# Altium project ESP32-HWE-Dev.PrjPcb
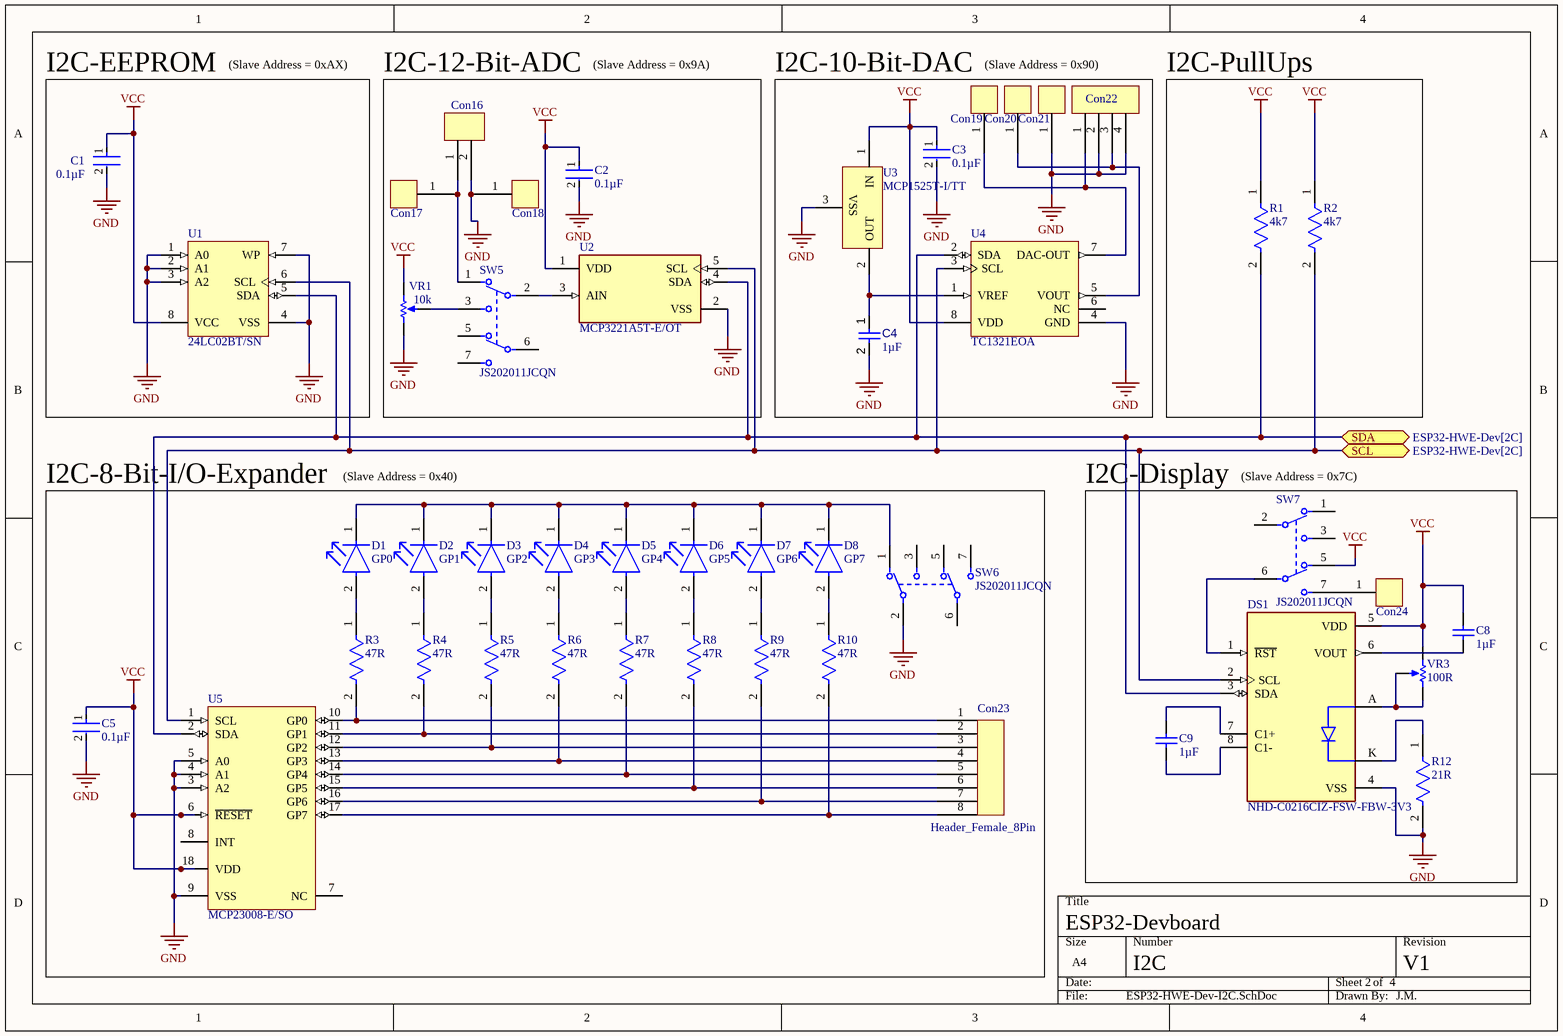
[diagram p0: ESP32-HWE-Dev-I2C.SchDoc]
4 sheets, 102 parts. Net scope: flat (ports and power ports of the same name join across sheets).
Board file: ESP32-HWE-Dev.PcbDoc
Sheets:
  ESP32-HWE-Dev-I2C.SchDoc
  ESP32-HWE-Dev-SPI.SchDoc
  ESP32-HWE-Dev.SchDoc
  ESP32-HWE-Dev-Power.SchDoc

## Sheet ESP32-HWE-Dev-I2C.SchDoc
size A4; SheetNumber: 1; SheetTotal: 4

### Parts
C1  0.1µF  [FP-0805-L_2_01_0_2-W_1_25-IPC_C]
C2  0.1µF  [FP-0805-L_2_01_0_2-W_1_25-IPC_C]
C3  0.1µF  [FP-0805-L_2_01_0_2-W_1_25-IPC_C]
C4  value 1µF  [CAPC2013X135X45NL10T25]  (hidden comment: Capacitor 1 uF +/- 10% 50 V 0805)
C5  0.1µF  [FP-0805-L_2_01_0_2-W_1_25-IPC_C]
C8  1µF  [CAPC2013X145X50LL20T25]
C9  1µF  [CAPC2013X145X50LL20T25]
Con16  Female 2 Pin  [Header_Female_2Pin]  (value not drawn)
Con17  Solder Nail RTM 1.3  [Solder_Nail_RTM_1.3]  (value not drawn)
Con18  Solder Nail RTM 1.3  [Solder_Nail_RTM_1.3]  (value not drawn)
Con19  I2C-DAC-DAC-Out  [Solder_Nail_RTM_1.3]  (value not drawn)
Con20  I2C-DAC-Vout  [Solder_Nail_RTM_1.3]  (value not drawn)
Con21  DAC-GND  [Solder_Nail_RTM_1.3]  (value not drawn)
Con22  Female 4 Pin  [Header_Female_4Pin]  (value not drawn)
Con23  Header_Female_8Pin  [Header_Female_8Pin]
Con24  Solder Nail RTM 1.3  [Solder_Nail_RTM_1.3]  (value not drawn)
D1  GP0  [FP-SML-LXT0805IW-TR-MFG]
D2  GP1  [FP-SML-LXT0805IW-TR-MFG]
D3  GP2  [FP-SML-LXT0805IW-TR-MFG]
D4  GP3  [FP-SML-LXT0805IW-TR-MFG]
D5  GP4  [FP-SML-LXT0805IW-TR-MFG]
D6  GP5  [FP-SML-LXT0805IW-TR-MFG]
D7  GP6  [FP-SML-LXT0805IW-TR-MFG]
D8  GP7  [FP-SML-LXT0805IW-TR-MFG]
DS1  NHD-C0216CIZ-FSW-FBW-3V3  [LCD_NHD-C0216CIZ-FSW-FBW-3V3]
R1  4k7  [FP-AC0805-MFG]
R2  4k7  [FP-AC0805-MFG]
R3  47R  [FP-AC0805-MFG]
R4  47R  [FP-AC0805-MFG]
R5  47R  [FP-AC0805-MFG]
R6  47R  [FP-AC0805-MFG]
R7  47R  [FP-AC0805-MFG]
R8  47R  [FP-AC0805-MFG]
R9  47R  [FP-AC0805-MFG]
R10  47R  [FP-AC0805-MFG]
R12  21R  [FP-AC0805-MFG]
SW5  JS202011JCQN  [FP-JS202011JCQN-MFG]
SW6  JS202011JCQN  [FP-JS202011JCQN-MFG]
SW7  JS202011JCQN  [FP-JS202011JCQN-MFG]
U1  24LC02BT/SN  [SOIC-SN8_N]
U2  MCP3221A5T-E/OT  [FP-C04-091-OT-IPC_A]
U3  MCP1525T-I/TT  [SOT-23-TT3_M]
U4  TC1321EOA  [SOIC-OA8_L]
U5  MCP23008-E/SO  [SOIC-SO18_N]
VR1  10k  [BOUR-3362P]
VR3  100R  [BOUR-3362P]

### Blocks framed on the sheet
I2C-EEPROM: C1 U1
I2C-12-Bit-ADC: C2 Con16-Con18 SW5 U2 VR1
I2C-10-Bit-DAC: C3 C4 Con19-Con22 U3 U4
I2C-PullUps: R1 R2
I2C-8-Bit-I/O-Expander: C5 Con23 D1-D8 R3-R10 SW6 U5
I2C-Display: C8 C9 Con24 DS1 R12 SW7 VR3

### Ports
SCL (bidir, see ESP32-HWE-Dev[2C]), SDA (bidir, see ESP32-HWE-Dev[2C])

### Nets
GND: C1.2 C2.2 C3.2 C4.2 C5.2 Con16.2 Con18.1 Con21.1 Con22.2 Con22.4 DS1.4(VSS) R12.2 SW6.2(1_C) U1.1(A0) U1.2(A1) U1.3(A2) U1.4(VSS) U1.7(WP) U2.2(VSS) U3.3(VSS) U4.4(GND) U5.3(A2) U5.4(A1) U5.5(A0) U5.9(VSS) VR1.1(CCW)
VCC: C1.1 C2.1 C3.1 C5.1 C8.2 DS1.5(VDD) R1.1 R2.1 SW7.5 U1.8(VCC) U2.1(VDD) U3.1(IN) U4.8(VDD) U5.6(~{RESET}) U5.18(VDD) VR1.3(CW) VR3.1(CCW)
NetC4_1: C4.1 U3.2(OUT) U4.1(VREF)
NetC8_1: C8.1 DS1.6(VOUT)
NetC9_1: C9.1 DS1.8(C1-)
NetC9_2: C9.2 DS1.7(C1+)
NetCon16_1: Con16.1 Con17.1 SW5.1
NetCon19_1: Con19.1 Con22.1 U4.7(DAC-OUT)
NetCon20_1: Con20.1 Con22.3 U4.5(VOUT)
NetCon23_1: Con23.1 R3.2 U5.10(GP0)
NetCon23_2: Con23.2 R4.2 U5.11(GP1)
NetCon23_3: Con23.3 R5.2 U5.12(GP2)
NetCon23_4: Con23.4 R6.2 U5.13(GP3)
NetCon23_5: Con23.5 R7.2 U5.14(GP4)
NetCon23_6: Con23.6 R8.2 U5.15(GP5)
NetCon23_7: Con23.7 R9.2 U5.16(GP6)
NetCon23_8: Con23.8 R10.2 U5.17(GP7)
NetCon24_1: Con24.1 SW7.7
NetD1_1: D1.1(C) D2.1(C) D3.1(C) D4.1(C) D5.1(C) D6.1(C) D7.1(C) D8.1(C) SW6.1
NetD1_2: D1.2(A) R3.1
NetD2_2: D2.2(A) R4.1
NetD3_2: D3.2(A) R5.1
NetD4_2: D4.2(A) R6.1
NetD5_2: D5.2(A) R7.1
NetD6_2: D6.2(A) R8.1
NetD7_2: D7.2(A) R9.1
NetD8_2: D8.2(A) R10.1
NetDS1_1: DS1.1(~{RST}) SW7.6(2_C)
NetDS1_2: DS1.2(SCL) R2.2 U1.6(SCL) U2.5(SCL) U4.3(SCL) U5.1(SCL) ; port SCL
NetDS1_3: DS1.3(SDA) R1.2 U1.5(SDA) U2.4(SDA) U4.2(SDA) U5.2(SDA) ; port SDA
NetDS1_A: DS1.A VR3.2(S) VR3.3(CW)
NetDS1_K: DS1.K R12.1
NetSW5_2: SW5.2(1_C) U2.3(AIN)
NetSW5_3: SW5.3 VR1.2(S)

Not connected (* = marked no-connect by the designer): SW5 5 6(2_C) 7; SW6 3 5 6(2_C) 7; SW7 1 2(1_C) 3; U4 6(NC); U5 7(NC) 8(INT)

### Notes on the sheet
- (Slave Address = 0xAX)
- (Slave Address = 0x9A)
- (Slave Address = 0x90)
- (Slave Address = 0x40)
- (near SW7) (Slave Address = 0x7C)
- ESP32-Devboard
- I2C
- 2
- 4
- V1
- J.M.

### Library data of the parts
C1-C3 C5 = CMP-2000-05016-2: General Purpose Ceramic Capacitor, 0805, 100nF, 10%, X7R, 0.15, 50V; Dissipation Factor: 2.5%; Insulation Resistance: 100GR; Voltage Rating (DC): 50V; Package Quantity: 4000; Tolerance: 10%; Voltage Rating: 50V; Dielectric: X7R; Case/Package: 0805; Lead Free: Lead Free; Dielectric Material: Ceramic; Thickness: 0.037inch; Weight: 0.001411oz; Max Operating Temperature: 125°C; REACH SVHC: No SVHC; Mount: Surface Mount; RoHS Compliant: Yes; Depth: 1.25mm; Height: 0.5mm; Case Code (Metric): 2012; Length: 2mm; Termination: Standard; Case Code (Imperial): 0805; Number of Pins: 2; Voltage: 50V; Radiation Hardening: No; Min Operating Temperature: -55°C; Capacitance: 100nF; Width: 1.2mm; Series: MLCC X7R; Packaging: Cut Tape
C4 = CMP-001-00007-6: Chip Capacitor, 1 uF, +/- 10%, 50 V, 0805 (2012 Metric); Capacitor Type: Ceramic; Voltage Rating: 50V; Min Operating Temperature: -55°C; RoHS Compliant: True; Mounting Technology: SM; Case/Package: 0805; Max Operating Temperature: 125°C; Tolerance: 10%; Pins: 2
C8 C9 = CMP-1036-04746-2: Manufacturer: Kemet; Part Number: C0805C105K4PACTU
Con16 = Header_Female_2Pin
Con17-Con21 Con24 = Solder_Nail_RTM_1.3
Con22 = Header_Female_4Pin
D1-D8 = CMP-1724-00002-2: LED RED DIFFUSED SMD; Lens Style: Rectangular; Luminous Intensity: 11mcd; Approvals: UL; Test Current: 20mA; Forward Voltage: 2V; Number of LEDs: 1; Wavelength: 635nm; Lens Color: White; Viewing Angle: 140°; Min Operating Temperature: -25°C; Case Code (Metric): 2012; Mount: Surface Mount; Case Code (Imperial): 0805; Height: 0.8mm; Lead Free: Lead Free; Color: Red; Package Quantity: 1; Illumination Color: Red; Lens Transparency: Diffused; Forward Current: 20mA; Packaging: Tape and Reel; Length: 2mm; Case/Package: 0805; REACH SVHC: No SVHC; Width: 1.25mm; Number of Pins: 2; Max Operating Temperature: 80°C; Dominant Wavelength: 635nm
DS1 = NHD-C0216CIZ-FSW-FBW-3V3: Character Display FSTN Transflective 16Char x 2Line 8-Pin; MF: {'manufacturer': u'Newhaven'}; Package: None; Price: None; Value: *; MP: NHD-C0216CIZ-FSW-FBW-3V3; Availability: Unavailable; ComponentLink1Description: Datasheet; ComponentLink1URL: https://s3.amazonaws.com/snapeda/datasheet/NHD-C0216CIZ-FSW-FBW-3V3_Newhaven.pdf
R1-R10 R12 = CMP-2001-04476-2: RES SMD 4.7K OHM 5% 1/8W 0805; Manufacturer: Yageo; Manufacturer Part Number: AC0805JR-074K7L; Tolerance: 0.05; Value: 4.7KΩ; Voltage Rating: 150V; Automotive Grade: Grade 0; ComponentLink2URL: http://www.yageo.com/documents/recent/PYu-AC_51_RoHS_L_6.pdf; Power Rating: 1/8W; Package: AC0805; Mouser Description: Thick Film Resistors - SMD 1/8W 4.7K ohm 5% AEC-Q200; Height: 0.6mm; Device Class L2: Resistors; ComponentLink2Description: Datasheet; Series: AC; RoHS: TRUE; Resistance: 4.7KΩ; Digikey Description: RES SMD 4.7K OHM 5% 1/8W 0805; Lead Free: Yes; Category: Res; Temperature Range Low: -55°C; Temperature Range High: +155°C; Composition: Thick Film; Device Class L3: Chip SMD Resistors; Device Class L1: Passive Components; Automotive: Yes; Octopart: https://octopart.com/ac0805jr-074k7l-yageo-26638632; Temperature: -55°C to +155°C; Ipc Land Pattern Name: RESC200125X50; Footprint Url: http://www.yageo.com/exep/pages/download/literatures/PYu-R_Mount_10.pdf
SW5-SW7 = CMP-10038-000009-1: SWITCH SLIDE DPDT 300MA 6V; Actuator Material: Nylon; Actuator Length: 2mm; Actuator Type: Standard; Electrical Life: 5000Cycles; Switch Function: On-On; Mount: Surface Mount; Current Rating: 300mA; Contact Material: Copper Alloy; Voltage Rating (DC): 6V; Throw Configuration: DPDT; Packaging: Cut Tape; Contact Plating: Silver; Min Operating Temperature: -40°C; Switch Travel: 2mm; Max Operating Temperature: 85°C
U1 = CMP-0159-00324-1: 2Kbit, 400kHz, 2.5V, I2C Serial EEPROM, 8-Pin SOIC 150mil, Commercial Temperature, Tape and Reel; Code_JEDEC: MS-012; PackageVersion: revBB, Aug-2009; DatasheetVersion: revJ, Feb-2009; PackageDescription: 8-Lead Plastic Small Outline (SN) - Narrow, 3.90mm Body [SOIC]; PackageReference: SOIC-SN8; Code_IPC: SOIC127P600-8
U2 = CMP-0188-00729-3: IC ADC 12BIT SAR SOT23-5; Number of Bits: 12; Number of Analog Inputs: 1; Min Supply Voltage: 2.7V; Integral Nonlinearity (INL): 2LSB; Sampling Rate: 22.3KS/s; Polarity: Unipolar; Interface: I2C; Max Supply Voltage: 5.5V; Resolution: 12b; Nominal Supply Current: 175uA; REACH SVHC: No SVHC; Packaging: Tape and Reel; Height: 1.3mm; Number of Channels: 1; Max Operating Temperature: 125°C; Mount: Surface Mount; Width: 1.8mm; Lead Free: Lead Free; Length: 3.1mm; Number of A/D Converters: 1; Number of Inputs: 1; Case/Package: SOT-23; Package Quantity: 3000; Conversion Rate: 22.3KS/s; Number of Converters: 1; Number of Elements: 1; Min Operating Temperature: -40°C; Number of Pins: 5; Termination: SMD/SMT; Radiation Hardening: No
U3 = CMP-0131-00003-1: 2.5V Voltage Reference, 3-Pin SOT-23, Industrial Temperature, Tape and Reel; DatasheetVersion: revB, Feb-2005; Code_IPC: SOT23-3; PackageDescription: 3-Lead Plastic Small Outline Transistor (TT) [SOT-23]; PackageReference: SOT-23-TT3; PackageVersion: revBB, Aug-2009
U4 = CMP-0188-00049-2: 10-Bit Digital-to-Analog Converter with Two-Wire Interface, 8-Pin SOIC 150mil, Extended Temperature; ComponentLink3URL: http://www.microchip.com/stellent/groups/techpub_sg/documents/packagingspec/en012702.pdf; ComponentLink2Description: Datasheet; ComponentLink1Description: Manufacturer URL; Code_IPC: SOIC127P600-8; ComponentLink2URL: http://ww1.microchip.com/downloads/en/DeviceDoc/21387C.pdf; PackageReference: SOIC-OA8; RevisionNote: URLs added. DatasheetVersion updated.; ComponentLink1URL: http://www.microchip.com/; DatasheetVersion: revC, Nov-2010; PackageVersion: revBB, Aug-2009; PackageDescription: 8-Lead Plastic Small Outline (OA) - Narrow, 3.90mm Body [SOIC]; ComponentLink3Description: Package Specification
U5 = CMP-0186-00050-2: 8-Bit I/O Expander with Serial Interface, 18-Pin SOIC, Extended Temperature; PackageDescription: 18-Lead Plastic Small Outline (SO) - Wide 7.50mm Body [SOIC]; ComponentLink3Description: Package Specification; ComponentLink2Description: Datasheet; ComponentLink2URL: http://ww1.microchip.com/downloads/en/DeviceDoc/21919e.pdf; RevisionNote: URLs added.; ComponentLink1URL: http://www.microchip.com/; ComponentLink3URL: http://www.microchip.com/stellent/groups/techpub_sg/documents/packagingspec/en012702.pdf; ComponentLink1Description: Manufacturer URL; PackageReference: SOIC-SO18; DatasheetVersion: revE, Aug-2007; PackageVersion: revBB, Aug-2009; Code_JEDEC: MS-013
VR1 VR3 = CMP-1747-00004-1: Square Trimpot(R) Trimming Potentiometer, 10 KOhm, 300 V, -55 to 125 degC, 3-Pin THD, RoHS, Tube; Voltage Rating: 220 mV; Power Rating: 1 W; Tolerance: 1%; Resistance: 50 mohm; Case/Package: 1206; Length: 3.2 mm; RoHSCompliant: True; PackageDescription: 3-Pin Through Hole Device, Body 6.6 x 6.99 mm, Pitch 2.54 mm; ComponentLink2Description: Datasheet; REACH SVHC: No SVHC; Mount: Surface Mount; Height: 0.6 mm; Packaging: Tape and Reel; ComponentLink1URL: http://www.bourns.com/; Case Code (Imperial): 0612; Pins: 2; Case Code (Metric): 1632; ComponentLink2URL: http://www.bourns.com/docs/Product-Datasheets/3362.pdf; Min Operating Temperature: -25degC; ComponentLink1Description: Manufacturer URL; PackageReference: 3326P; Max Operating Temperature: 125degC; Width: 1.6 mm; Package Quantity: 5000; DatasheetVersion: May-16

## Sheet ESP32-HWE-Dev-SPI.SchDoc
size A4; SheetNumber: 2; SheetTotal: 4
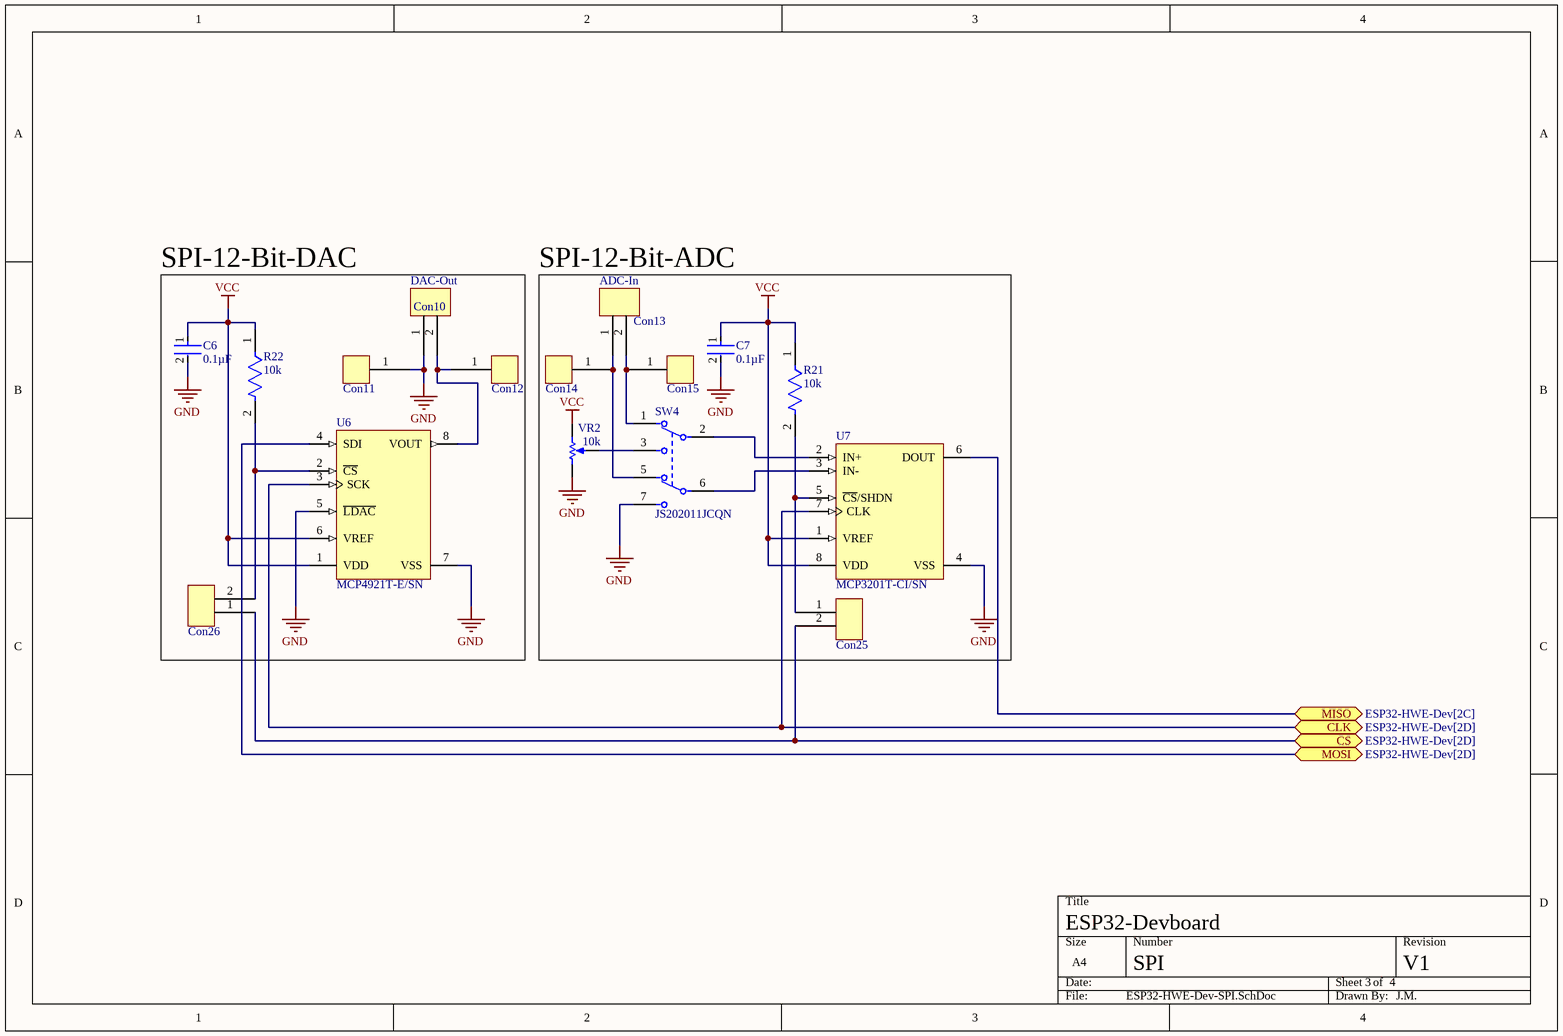
[diagram p1: ESP32-HWE-Dev-SPI.SchDoc]

### Parts
C6  0.1µF  [FP-0805-L_2_01_0_2-W_1_25-IPC_C]
C7  0.1µF  [FP-0805-L_2_01_0_2-W_1_25-IPC_C]
Con10  DAC-Out  [Header_Female_2Pin]
Con11  Solder Nail RTM 1.3  [Solder_Nail_RTM_1.3]  (value not drawn)
Con12  Solder Nail RTM 1.3  [Solder_Nail_RTM_1.3]  (value not drawn)
Con13  ADC-In  [Header_Female_2Pin]
Con14  Solder Nail RTM 1.3  [Solder_Nail_RTM_1.3]  (value not drawn)
Con15  Solder Nail RTM 1.3  [Solder_Nail_RTM_1.3]  (value not drawn)
Con25  Male 2 Pin  [Header_Male_2Pin]  (value not drawn)
Con26  Male 2 Pin  [Header_Male_2Pin]  (value not drawn)
R21  10k  [FP-AC0805-MFG]
R22  10k  [FP-AC0805-MFG]
SW4  JS202011JCQN  [FP-JS202011JCQN-MFG]
U6  MCP4921T-E/SN  [SOIC-SN8_L]
U7  MCP3201T-CI/SN  [SOIC-SN8_M]
VR2  10k  [BOUR-3362P]

### Blocks framed on the sheet
SPI-12-Bit-DAC: C6 Con10-Con12 Con26 R22 U6
SPI-12-Bit-ADC: C7 Con13-Con15 Con25 R21 SW4 U7 VR2

### Ports
CLK (bidir, see ESP32-HWE-Dev[2D]), CS (bidir, see ESP32-HWE-Dev[2D]), MISO (bidir, see ESP32-HWE-Dev[2C]), MOSI (bidir, see ESP32-HWE-Dev[2D])

### Nets
GND: C6.2 C7.2 Con10.1 Con11.1 SW4.7 U6.5(~{LDAC}) U6.7(VSS) U7.4(VSS) VR2.1(CCW)
VCC: C6.1 C7.1 R21.1 R22.1 U6.1(VDD) U6.6(VREF) U7.1(VREF) U7.8(VDD) VR2.3(CW)
NetCon10_2: Con10.2 Con12.1 U6.8(VOUT)
NetCon13_1: Con13.1 Con14.1 SW4.5
NetCon13_2: Con13.2 Con15.1 SW4.1
NetCon25_1: Con25.1 R21.2 U7.5(~{CS}/SHDN)
NetCon25_2: Con25.2 Con26.1 ; port CS
NetCon26_2: Con26.2 R22.2 U6.2(~{CS})
NetSW2_2: U7.6(DOUT) ; port MISO
NetSW2_6: U6.4(SDI) ; port MOSI
NetSW3_2: U6.3(SCK) U7.7(CLK) ; port CLK
NetSW4_2: SW4.2(1_C) U7.2(IN+)
NetSW4_3: SW4.3 VR2.2(S)
NetSW4_6: SW4.6(2_C) U7.3(IN-)

### Notes on the sheet
- ESP32-Devboard
- SPI
- 3
- 4
- V1
- J.M.

### Library data of the parts
C6 C7 = CMP-2000-05016-2: as C1 on sheet ESP32-HWE-Dev-I2C; Voltage Rating (DC): 50V; Package Quantity: 4000; Tolerance: 10%; Voltage Rating: 50V; Dielectric: X7R; Case/Package: 0805; Lead Free: Lead Free; Dielectric Material: Ceramic; Thickness: 0.037inch; Weight: 0.001411oz; Max Operating Temperature: 125°C; REACH SVHC: No SVHC; Mount: Surface Mount; RoHS Compliant: Yes; Depth: 1.25mm; Height: 0.5mm; Case Code (Metric): 2012; Length: 2mm; Termination: Standard; Case Code (Imperial): 0805; Number of Pins: 2; Voltage: 50V; Radiation Hardening: No; Min Operating Temperature: -55°C; Capacitance: 100nF; Width: 1.2mm; Series: MLCC X7R; Packaging: Cut Tape
Con10 Con13 = Header_Female_2Pin
Con11 Con12 Con14 Con15 = Solder_Nail_RTM_1.3
Con25 Con26 = Header_Male_2Pin
R21 R22 = CMP-2001-04476-2: as R1 on sheet ESP32-HWE-Dev-I2C; ComponentLink2URL: http://www.yageo.com/documents/recent/PYu-AC_51_RoHS_L_6.pdf; Power Rating: 1/8W; Package: AC0805; Mouser Description: Thick Film Resistors - SMD 1/8W 4.7K ohm 5% AEC-Q200; Height: 0.6mm; Device Class L2: Resistors; ComponentLink2Description: Datasheet; Series: AC; RoHS: TRUE; Resistance: 4.7KΩ; Digikey Description: RES SMD 4.7K OHM 5% 1/8W 0805; Lead Free: Yes; Category: Res; Temperature Range Low: -55°C; Temperature Range High: +155°C; Composition: Thick Film; Device Class L3: Chip SMD Resistors; Device Class L1: Passive Components; Automotive: Yes; Octopart: https://octopart.com/ac0805jr-074k7l-yageo-26638632; Temperature: -55°C to +155°C; Ipc Land Pattern Name: RESC200125X50; Footprint Url: http://www.yageo.com/exep/pages/download/literatures/PYu-R_Mount_10.pdf
SW4 = CMP-10038-000009-1: as SW5 on sheet ESP32-HWE-Dev-I2C; Mount: Surface Mount; Current Rating: 300mA; Contact Material: Copper Alloy; Voltage Rating (DC): 6V; Throw Configuration: DPDT; Packaging: Cut Tape; Contact Plating: Silver; Min Operating Temperature: -40°C; Switch Travel: 2mm; Max Operating Temperature: 85°C
U6 = CMP-0188-00494-2: 12-Bit DAC with SPI Interface, 8-Pin SOIC 150mil, Extended Temperature, Tape and Reel; DatasheetVersion: revA, Apr-2010; RevisionNote: URLs added. DatasheetVersion updated. Sch updated.; ComponentLink2Description: Datasheet; ComponentLink3Description: Package Specification; ComponentLink1Description: Manufacturer URL; ComponentLink2URL: http://ww1.microchip.com/downloads/en/DeviceDoc/22248a.pdf; PackageDescription: 8-Lead Plastic Small Outline (SN) - Narrow, 3.90mm Body [SOIC]; PackageVersion: revBB, Aug-2009; Code_JEDEC: MS-012; Code_IPC: SOIC127P600-8; ComponentLink1URL: http://www.microchip.com/; PackageReference: SOIC-SN8; ComponentLink3URL: http://www.microchip.com/stellent/groups/techpub_sg/documents/packagingspec/en012702.pdf
U7 = CMP-0188-00467-2: 2.7V 12-Bit A/D Converter with SPI Serial Interface, 8-Pin SOIC 150mil, C Performance Grade, Industrial Temperature, Tape and Reel; RevisionNote: URLs added. DatasheetVersion updated.; PackageVersion: revBB, Aug-2009; ComponentLink2URL: http://ww1.microchip.com/downloads/en/DeviceDoc/21290F.pdf; DatasheetVersion: revF, Aug-2011; ComponentLink1URL: http://www.microchip.com/; Code_IPC: SOIC127P600-8; ComponentLink1Description: Manufacturer URL; ComponentLink3Description: Package Specification; PackageReference: SOIC-SN8; ComponentLink3URL: http://www.microchip.com/stellent/groups/techpub_sg/documents/packagingspec/en012702.pdf; PackageDescription: 8-Lead Plastic Small Outline (SN) - Narrow, 3.90mm Body [SOIC]; Code_JEDEC: MS-012; ComponentLink2Description: Datasheet
VR2 = CMP-1747-00004-1: as VR1 on sheet ESP32-HWE-Dev-I2C; Case/Package: 1206; Length: 3.2 mm; RoHSCompliant: True; PackageDescription: 3-Pin Through Hole Device, Body 6.6 x 6.99 mm, Pitch 2.54 mm; ComponentLink2Description: Datasheet; REACH SVHC: No SVHC; Mount: Surface Mount; Height: 0.6 mm; Packaging: Tape and Reel; ComponentLink1URL: http://www.bourns.com/; Case Code (Imperial): 0612; Pins: 2; Case Code (Metric): 1632; ComponentLink2URL: http://www.bourns.com/docs/Product-Datasheets/3362.pdf; Min Operating Temperature: -25degC; ComponentLink1Description: Manufacturer URL; PackageReference: 3326P; Max Operating Temperature: 125degC; Width: 1.6 mm; Package Quantity: 5000; DatasheetVersion: May-16

## Sheet ESP32-HWE-Dev.SchDoc
size A4; SheetNumber: 3; SheetTotal: 4
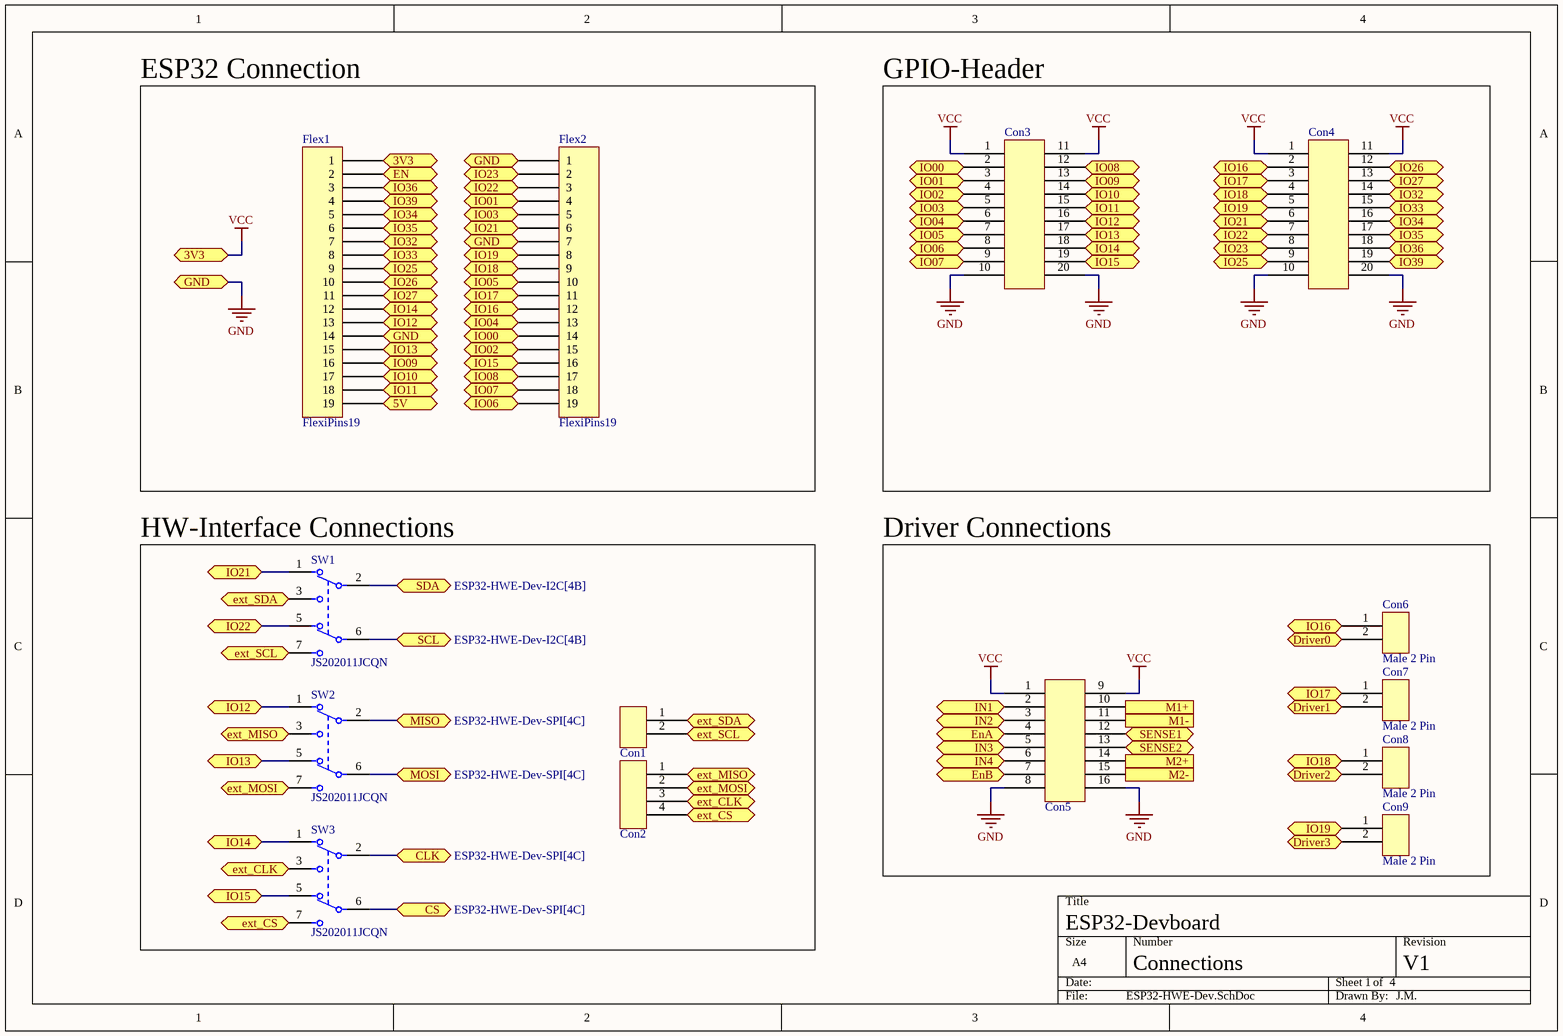
[diagram p2: ESP32-HWE-Dev.SchDoc]

### Parts
Con1  Female 2 Pin  [Header_Female_2Pin]  (value not drawn)
Con2  Female 4 Pin  [Header_Female_4Pin]  (value not drawn)
Con3  Female 2x10 Pin  [Header_Female_2x10Pin]  (value not drawn)
Con4  Female 2x10 Pin  [Header_Female_2x10Pin]  (value not drawn)
Con5  Female 2x8 Pin  [Header_Female_2x8Pin]  (value not drawn)
Con6  Male 2 Pin  [Header_Male_2Pin]
Con7  Male 2 Pin  [Header_Male_2Pin]
Con8  Male 2 Pin  [Header_Male_2Pin]
Con9  Male 2 Pin  [Header_Male_2Pin]
Flex1  FlexiPins19  [FlexiPins19]
Flex2  FlexiPins19  [FlexiPins19]
SW1  JS202011JCQN  [FP-JS202011JCQN-MFG]
SW2  JS202011JCQN  [FP-JS202011JCQN-MFG]
SW3  JS202011JCQN  [FP-JS202011JCQN-MFG]

### Blocks framed on the sheet
ESP32 Connection: Flex1 Flex2
GPIO-Header: Con3 Con4
HW-Interface Connections: Con1 Con2 SW1-SW3
Driver Connections: Con5-Con9

### Ports
3V3 (bidir, see ESP32-HWE-Dev[1A]), 5V (bidir), CLK (bidir, see ESP32-HWE-Dev-SPI[4C]), CS (bidir, see ESP32-HWE-Dev-SPI[4C]), Driver0 (bidir, see ESP32-HWE-Dev-Power[2B]), Driver1 (bidir, see ESP32-HWE-Dev-Power[3B]), Driver2 (bidir, see ESP32-HWE-Dev-Power[2C]), Driver3 (bidir, see ESP32-HWE-Dev-Power[3C]), EN (bidir), EnA (bidir, see ESP32-HWE-Dev-Power[1C]), EnB (bidir, see ESP32-HWE-Dev-Power[1C]), ext_CLK (bidir, see ESP32-HWE-Dev[1D]), ext_CLK (bidir, see ESP32-HWE-Dev[2D]), ext_CS (bidir, see ESP32-HWE-Dev[1D]), ext_CS (bidir, see ESP32-HWE-Dev[2D]), ext_MISO (bidir, see ESP32-HWE-Dev[1C]), ext_MISO (bidir, see ESP32-HWE-Dev[2D]), ext_MOSI (bidir, see ESP32-HWE-Dev[1D]), ext_MOSI (bidir, see ESP32-HWE-Dev[2D]), ext_SCL (bidir, see ESP32-HWE-Dev[1C]), ext_SCL (bidir, see ESP32-HWE-Dev[2C]), ext_SDA (bidir, see ESP32-HWE-Dev[1C]), ext_SDA (bidir, see ESP32-HWE-Dev[2C]), GND (bidir, see ESP32-HWE-Dev[1B], ESP32-HWE-Dev[2A]), IN1 (bidir, see ESP32-HWE-Dev-Power[1C]), IN2 (bidir, see ESP32-HWE-Dev-Power[1C]), IN3 (bidir, see ESP32-HWE-Dev-Power[1C]), IN4 (bidir, see ESP32-HWE-Dev-Power[1C]), IO00 (bidir, see ESP32-HWE-Dev[2B]), IO00 (bidir, see ESP32-HWE-Dev[3A]), IO01 (bidir, see ESP32-HWE-Dev[2A]), IO01 (bidir, see ESP32-HWE-Dev[3A]), IO02 (bidir, see ESP32-HWE-Dev[2B]), IO02 (bidir, see ESP32-HWE-Dev[3A]), IO03 (bidir, see ESP32-HWE-Dev[2A]), IO03 (bidir, see ESP32-HWE-Dev[3A]), IO04 (bidir, see ESP32-HWE-Dev[2B]), IO04 (bidir, see ESP32-HWE-Dev[3A]), IO05 (bidir, see ESP32-HWE-Dev[2B]), IO05 (bidir, see ESP32-HWE-Dev[3A]), IO06 (bidir, see ESP32-HWE-Dev[2B]), IO06 (bidir, see ESP32-HWE-Dev[3A]), IO07 (bidir, see ESP32-HWE-Dev[2B]), IO07 (bidir, see ESP32-HWE-Dev[3B]), IO08 (bidir, see ESP32-HWE-Dev[2B]), IO08 (bidir, see ESP32-HWE-Dev[3A]), IO09 (bidir, see ESP32-HWE-Dev[1B]), IO09 (bidir, see ESP32-HWE-Dev[3A]), IO10 (bidir, see ESP32-HWE-Dev[1B]), IO10 (bidir, see ESP32-HWE-Dev[3A]), IO11 (bidir, see ESP32-HWE-Dev[1B]), IO11 (bidir, see ESP32-HWE-Dev[3A]), IO12 (bidir, see ESP32-HWE-Dev[1B], ESP32-HWE-Dev[1C]), IO12 (bidir, see ESP32-HWE-Dev[1B], ESP32-HWE-Dev[3A]), IO12 (bidir, see ESP32-HWE-Dev[1C], ESP32-HWE-Dev[3A]), IO13 (bidir, see ESP32-HWE-Dev[1B], ESP32-HWE-Dev[1C]), IO13 (bidir, see ESP32-HWE-Dev[1B], ESP32-HWE-Dev[3A]), IO13 (bidir, see ESP32-HWE-Dev[1C], ESP32-HWE-Dev[3A]), IO14 (bidir, see ESP32-HWE-Dev[1B], ESP32-HWE-Dev[1D]), IO14 (bidir, see ESP32-HWE-Dev[1B], ESP32-HWE-Dev[3A]), IO14 (bidir, see ESP32-HWE-Dev[1D], ESP32-HWE-Dev[3A]), IO15 (bidir, see ESP32-HWE-Dev[1D], ESP32-HWE-Dev[2B]), IO15 (bidir, see ESP32-HWE-Dev[1D], ESP32-HWE-Dev[3B]), IO15 (bidir, see ESP32-HWE-Dev[2B], ESP32-HWE-Dev[3B]), IO16 (bidir, see ESP32-HWE-Dev[2B], ESP32-HWE-Dev[4A]), IO16 (bidir, see ESP32-HWE-Dev[2B], ESP32-HWE-Dev[4C]), IO16 (bidir, see ESP32-HWE-Dev[4A], ESP32-HWE-Dev[4C]), IO17 (bidir, see ESP32-HWE-Dev[2B], ESP32-HWE-Dev[4A]), IO17 (bidir, see ESP32-HWE-Dev[2B], ESP32-HWE-Dev[4C]), IO17 (bidir, see ESP32-HWE-Dev[4A], ESP32-HWE-Dev[4C]), IO18 (bidir, see ESP32-HWE-Dev[2B], ESP32-HWE-Dev[4A]), IO18 (bidir, see ESP32-HWE-Dev[2B], ESP32-HWE-Dev[4C]), IO18 (bidir, see ESP32-HWE-Dev[4A], ESP32-HWE-Dev[4C]), IO19 (bidir, see ESP32-HWE-Dev[2A], ESP32-HWE-Dev[4A]), IO19 (bidir, see ESP32-HWE-Dev[2A], ESP32-HWE-Dev[4D]), IO19 (bidir, see ESP32-HWE-Dev[4A], ESP32-HWE-Dev[4D]), IO21 (bidir, see ESP32-HWE-Dev[1C], ESP32-HWE-Dev[2A]), IO21 (bidir, see ESP32-HWE-Dev[1C], ESP32-HWE-Dev[4A]), IO21 (bidir, see ESP32-HWE-Dev[2A], ESP32-HWE-Dev[4A]), IO22 (bidir, see ESP32-HWE-Dev[1C], ESP32-HWE-Dev[2A]), IO22 (bidir, see ESP32-HWE-Dev[1C], ESP32-HWE-Dev[4A]), IO22 (bidir, see ESP32-HWE-Dev[2A], ESP32-HWE-Dev[4A]), IO23 (bidir, see ESP32-HWE-Dev[2A]), IO23 (bidir, see ESP32-HWE-Dev[4A]), IO25 (bidir, see ESP32-HWE-Dev[1B]), IO25 (bidir, see ESP32-HWE-Dev[4B]), IO26 (bidir, see ESP32-HWE-Dev[1B]), IO26 (bidir, see ESP32-HWE-Dev[4A]), IO27 (bidir, see ESP32-HWE-Dev[1B]), IO27 (bidir, see ESP32-HWE-Dev[4A]), IO32 (bidir, see ESP32-HWE-Dev[1A]), IO32 (bidir, see ESP32-HWE-Dev[4A]), IO33 (bidir, see ESP32-HWE-Dev[1A]), IO33 (bidir, see ESP32-HWE-Dev[4A]), IO34 (bidir, see ESP32-HWE-Dev[1A]), IO34 (bidir, see ESP32-HWE-Dev[4A]), IO35 (bidir, see ESP32-HWE-Dev[1A]), IO35 (bidir, see ESP32-HWE-Dev[4A]), IO36 (bidir, see ESP32-HWE-Dev[1A]), IO36 (bidir, see ESP32-HWE-Dev[4A]), IO39 (bidir, see ESP32-HWE-Dev[1A]), IO39 (bidir, see ESP32-HWE-Dev[4B]), M1+ (in, see ESP32-HWE-Dev-Power[2C]), M1- (in, see ESP32-HWE-Dev-Power[2C]), M2+ (in, see ESP32-HWE-Dev-Power[2C]), M2- (in, see ESP32-HWE-Dev-Power[2C]), MISO (bidir, see ESP32-HWE-Dev-SPI[4C]), MOSI (bidir, see ESP32-HWE-Dev-SPI[4C]), SCL (bidir, see ESP32-HWE-Dev-I2C[4B]), SDA (bidir, see ESP32-HWE-Dev-I2C[4B]), SENSE1 (bidir, see ESP32-HWE-Dev-Power[2C]), SENSE2 (bidir, see ESP32-HWE-Dev-Power[2C])

### Nets
GND: Con3.10 Con3.20 Con4.10 Con4.20 Con5.8 Con5.16 Flex1.14 Flex2.1 Flex2.7 ; port GND
VCC: Con3.1 Con3.11 Con4.1 Con4.11 Con5.1 Con5.9 Flex1.1 ; port 3V3
NetCon1_1: Con1.1 SW1.3 ; port ext_SDA
NetCon1_2: Con1.2 SW1.7 ; port ext_SCL
NetCon2_1: Con2.1 SW2.3 ; port ext_MISO
NetCon2_2: Con2.2 SW2.7 ; port ext_MOSI
NetCon2_3: Con2.3 SW3.3 ; port ext_CLK
NetCon2_4: Con2.4 SW3.7 ; port ext_CS
NetCon3_2: Con3.2 Flex2.14 ; port IO00
NetCon3_3: Con3.3 Flex2.4 ; port IO01
NetCon3_4: Con3.4 Flex2.15 ; port IO02
NetCon3_5: Con3.5 Flex2.5 ; port IO03
NetCon3_6: Con3.6 Flex2.13 ; port IO04
NetCon3_7: Con3.7 Flex2.10 ; port IO05
NetCon3_8: Con3.8 Flex2.19 ; port IO06
NetCon3_9: Con3.9 Flex2.18 ; port IO07
NetCon3_12: Con3.12 Flex2.17 ; port IO08
NetCon3_13: Con3.13 Flex1.16 ; port IO09
NetCon3_14: Con3.14 Flex1.17 ; port IO10
NetCon3_15: Con3.15 Flex1.18 ; port IO11
NetCon3_16: Con3.16 Flex1.13 SW2.1 ; port IO12
NetCon3_17: Con3.17 Flex1.15 SW2.5 ; port IO13
NetCon3_18: Con3.18 Flex1.12 SW3.1 ; port IO14
NetCon3_19: Con3.19 Flex2.16 SW3.5 ; port IO15
NetCon4_2: Con4.2 Con6.1 Flex2.12 ; port IO16
NetCon4_3: Con4.3 Con7.1 Flex2.11 ; port IO17
NetCon4_4: Con4.4 Con8.1 Flex2.9 ; port IO18
NetCon4_5: Con4.5 Con9.1 Flex2.8 ; port IO19
NetCon4_6: Con4.6 Flex2.6 SW1.1 ; port IO21
NetCon4_7: Con4.7 Flex2.3 SW1.5 ; port IO22
NetCon4_8: Con4.8 Flex2.2 ; port IO23
NetCon4_9: Con4.9 Flex1.9 ; port IO25
NetCon4_12: Con4.12 Flex1.10 ; port IO26
NetCon4_13: Con4.13 Flex1.11 ; port IO27
NetCon4_14: Con4.14 Flex1.7 ; port IO32
NetCon4_15: Con4.15 Flex1.8 ; port IO33
NetCon4_16: Con4.16 Flex1.5 ; port IO34
NetCon4_17: Con4.17 Flex1.6 ; port IO35
NetCon4_18: Con4.18 Flex1.3 ; port IO36
NetCon4_19: Con4.19 Flex1.4 ; port IO39
NetCon5_2: Con5.2 ; port IN1
NetCon5_3: Con5.3 ; port IN2
NetCon5_4: Con5.4 ; port EnA
NetCon5_5: Con5.5 ; port IN3
NetCon5_6: Con5.6 ; port IN4
NetCon5_7: Con5.7 ; port EnB
NetCon5_10: Con5.10 ; port M1+
NetCon5_11: Con5.11 ; port M1-
NetCon5_12: Con5.12 ; port SENSE1
NetCon5_13: Con5.13 ; port SENSE2
NetCon5_14: Con5.14 ; port M2+
NetCon5_15: Con5.15 ; port M2-
NetCon6_2: Con6.2 ; port Driver0
NetCon7_2: Con7.2 ; port Driver1
NetCon8_2: Con8.2 ; port Driver2
NetCon9_2: Con9.2 ; port Driver3
NetCon25_2: SW3.6(2_C) ; port CS
NetDS1_2: SW1.6(2_C) ; port SCL
NetDS1_3: SW1.2(1_C) ; port SDA
NetFlex1_2: Flex1.2 ; port EN
NetFlex1_19: Flex1.19 ; port 5V
NetSW2_2: SW2.2(1_C) ; port MISO
NetSW2_6: SW2.6(2_C) ; port MOSI
NetSW3_2: SW3.2(1_C) ; port CLK

### Notes on the sheet
- ESP32-Devboard
- Connections
- 1
- 4
- V1
- J.M.

### Library data of the parts
Con1 = Header_Female_2Pin
Con2 = Header_Female_4Pin
Con3 Con4 = Header_Female_2x10Pin
Con5 = Header_Female_2x8Pin
Con6-Con9 = Header_Male_2Pin
SW1-SW3 = CMP-10038-000009-1: as SW5 on sheet ESP32-HWE-Dev-I2C; Mount: Surface Mount; Current Rating: 300mA; Contact Material: Copper Alloy; Voltage Rating (DC): 6V; Throw Configuration: DPDT; Packaging: Cut Tape; Contact Plating: Silver; Min Operating Temperature: -40°C; Switch Travel: 2mm; Max Operating Temperature: 85°C

## Sheet ESP32-HWE-Dev-Power.SchDoc
size A4; SheetNumber: 4; SheetTotal: 4
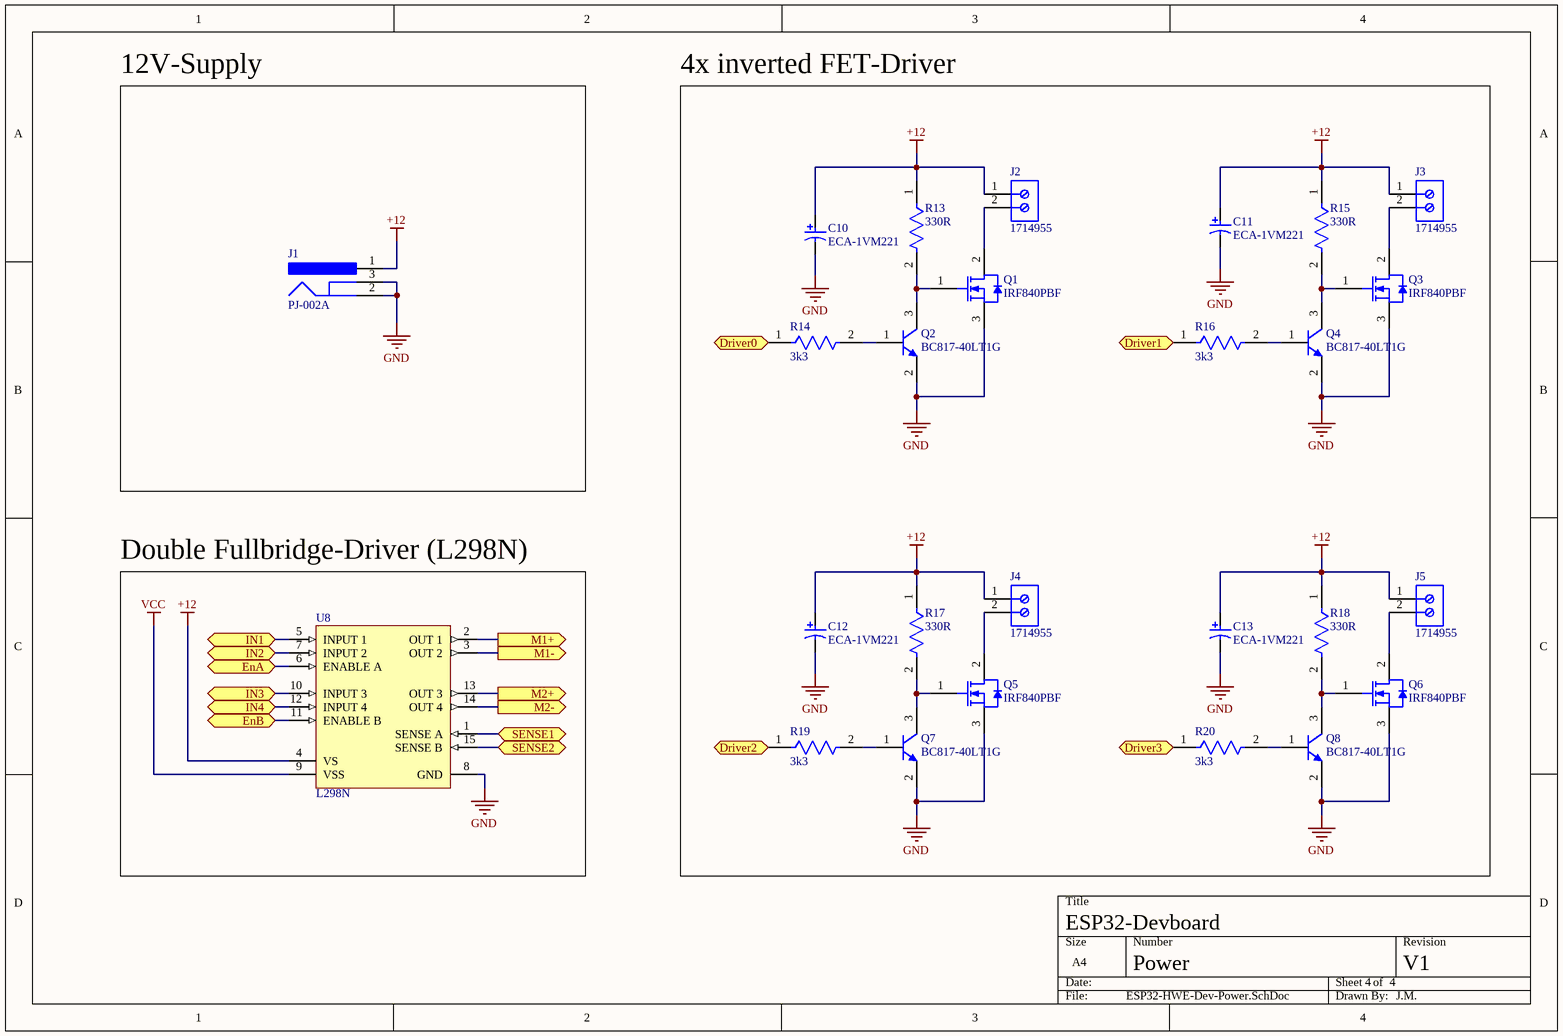
[diagram p3: ESP32-HWE-Dev-Power.SchDoc]

### Parts
C10  ECA-1VM221  [PNSC-ECA-1VM221-2]
C11  ECA-1VM221  [PNSC-ECA-1VM221-2]
C12  ECA-1VM221  [PNSC-ECA-1VM221-2]
C13  ECA-1VM221  [PNSC-ECA-1VM221-2]
J1  PJ-002A  [CUI-PJ-002A_V]
J2  1714955  [PHOE-1714955_V]
J3  1714955  [PHOE-1714955_V]
J4  1714955  [PHOE-1714955_V]
J5  1714955  [PHOE-1714955_V]
Q1  IRF840PBF  [VISH-TO-220AB-3]
Q2  BC817-40LT1G  [ONSC-SOT-23-3-318-08_V]
Q3  IRF840PBF  [VISH-TO-220AB-3]
Q4  BC817-40LT1G  [ONSC-SOT-23-3-318-08_V]
Q5  IRF840PBF  [VISH-TO-220AB-3]
Q6  IRF840PBF  [VISH-TO-220AB-3]
Q7  BC817-40LT1G  [ONSC-SOT-23-3-318-08_V]
Q8  BC817-40LT1G  [ONSC-SOT-23-3-318-08_V]
R13  330R  [FP-AC0805-MFG]
R14  3k3  [FP-AC0805-MFG]
R15  330R  [FP-AC0805-MFG]
R16  3k3  [FP-AC0805-MFG]
R17  330R  [FP-AC0805-MFG]
R18  330R  [FP-AC0805-MFG]
R19  3k3  [FP-AC0805-MFG]
R20  3k3  [FP-AC0805-MFG]
U8  L298N  [STM-FM-15]

### Ports
Driver0 (bidir, see ESP32-HWE-Dev[4C]), Driver1 (bidir, see ESP32-HWE-Dev[4C]), Driver2 (bidir, see ESP32-HWE-Dev[4D]), Driver3 (bidir, see ESP32-HWE-Dev[4D]), EnA (bidir, see ESP32-HWE-Dev[3C]), EnB (bidir, see ESP32-HWE-Dev[3D]), IN1 (bidir, see ESP32-HWE-Dev[3C]), IN2 (bidir, see ESP32-HWE-Dev[3C]), IN3 (bidir, see ESP32-HWE-Dev[3C]), IN4 (bidir, see ESP32-HWE-Dev[3C]), M1+ (out, see ESP32-HWE-Dev[3C]), M1- (out, see ESP32-HWE-Dev[3C]), M2+ (out, see ESP32-HWE-Dev[3C]), M2- (out, see ESP32-HWE-Dev[3D]), SENSE1 (bidir, see ESP32-HWE-Dev[3C]), SENSE2 (bidir, see ESP32-HWE-Dev[3C])

### Nets
+12: C10.1 C11.1 C12.1 C13.1 J1.1 J2.1 J3.1 J4.1 J5.1 R13.1 R15.1 R17.1 R18.1 U8.4(VS)
GND: C10.2 C11.2 C12.2 C13.2 J1.2 J1.3 Q1.3(S) Q2.2(E) Q3.3(S) Q4.2(E) Q5.3(S) Q6.3(S) Q7.2(E) Q8.2(E) U8.8(GND)
VCC: U8.9(VSS)
NetCon5_2: U8.5(INPUT_1) ; port IN1
NetCon5_3: U8.7(INPUT_2) ; port IN2
NetCon5_4: U8.6(ENABLE_A) ; port EnA
NetCon5_5: U8.10(INPUT_3) ; port IN3
NetCon5_6: U8.12(INPUT_4) ; port IN4
NetCon5_7: U8.11(ENABLE_B) ; port EnB
NetCon5_10: U8.2(OUT_1) ; port M1+
NetCon5_11: U8.3(OUT_2) ; port M1-
NetCon5_12: U8.1(SENSE_A) ; port SENSE1
NetCon5_13: U8.15(SENSE_B) ; port SENSE2
NetCon5_14: U8.13(OUT_3) ; port M2+
NetCon5_15: U8.14(OUT_4) ; port M2-
NetCon6_2: R14.1 ; port Driver0
NetCon7_2: R16.1 ; port Driver1
NetCon8_2: R19.1 ; port Driver2
NetCon9_2: R20.1 ; port Driver3
NetJ2_2: J2.2 Q1.2(D)
NetJ3_2: J3.2 Q3.2(D)
NetJ4_2: J4.2 Q5.2(D)
NetJ5_2: J5.2 Q6.2(D)
NetQ1_1: Q1.1(G) Q2.3(C) R13.2
NetQ2_1: Q2.1(B) R14.2
NetQ3_1: Q3.1(G) Q4.3(C) R15.2
NetQ4_1: Q4.1(B) R16.2
NetQ5_1: Q5.1(G) Q7.3(C) R17.2
NetQ6_1: Q6.1(G) Q8.3(C) R18.2
NetQ7_1: Q7.1(B) R19.2
NetQ8_1: Q8.1(B) R20.2

### Notes on the sheet
- 12V-Supply
- 4x inverted FET-Driver
- Double Fullbridge-Driver (L298N)
- ESP32-Devboard
- Power
- 4
- V1
- J.M.

### Library data of the parts
C10-C13 = CMP-2000-05311-1: Aluminum Electrolytic Capacitor, 220 uF, +/- 20%, 35 V, -40 to 85 degC, 2-Pin THD, RoHS, Bulk; Manufacturer: Panasonic; Lifetime@Temperature: 2000Hrs@85degC; Rated Voltage: 35V; Ripple Current: 350mA; Type: Radial; Capacitance: 220µF; Package Reference: ECA-1VM221; Series: M; Operating Temp Range: -40to+85degC; Package Description: 2-Pin Axial Lead, Dia 8 mm, Body Length 12.5 mm; Datasheet Version: Mar-06; Datasheet URL: https://datasheet.ciiva.com/26341/441851-da-01-en-elko-eca1vm221-m-r-220myf-35v-85c-26341906.pdf; Operating Temp-Max: 85degC; Case Size/Dimension: Ø8x11.5mm; Manufacturer URL: http://www.panasonic.com/
J1 = CMP-2000-06895-2: Through Hole Right Angle DC Power Jack, 2.5 A, 2 mm Center Pin, 3 Position, -25 to 85 degC, RoHS, Bulk; Manufacturer: CUIInc.; Brand: CUI; Inside Contact Diameter: 2mm; Voltage Rating: 24V; Outside Contact Diameter: 6.5mm; Current Rating: 2.5A; Insulation Resistance: 50MOhms; Contact Gender: Male; Connector Type: DCPowerJack; Datasheet Version: Rev. 1.03, 04/2016; Housing Material: PolybutyleneTerephthalate(PBT); Operating Temperature Range: -25Cto+85C; Termination Style: ThroughHole; Product Category: DCPowerConnectors; Mounting Technology: ThroughHole; Mounting Style: ThroughHole; Factory Pack Quantity: 500; Contact Plating: Nickel; Package Reference: PJ-002A; Mounting Angle: Right; Package Description: 3-Pin Through Hole Device, Body 14.4 x 9 mm, Height 11 mm; Flammability Rating: UL94V-0; Manufacturer URL: http://www.cui.com/; Product: Jacks; Contact Material: Copper; Datasheet URL: http://www.cui.com/product/resource/pj-002a.pdf; RoHS: True
J2-J5 = CMP-2000-05797-1: PC Terminal Block, Pitch 6.35 mm, 1 x 2 Position, Height 21.5 mm, Tail Lenght 5.1 mm, RoHS, Bulk; Manufacturer: Phoenix Contact; Package Description: PC Terminal Block, Pitch 6.35 mm, 1 x 2 Position, Height 21.5 mm, Tail Lenght 5.1 mm; Datasheet URL: http://media.digikey.com/pdf/Data%20Sheets/Phoenix%20Contact%20PDFs/1714955.pdf; Package Reference: 1714955; Manufacturer URL: http://www.phoenixcontact.com/; Datasheet Version: 02/2010; Mounting Technology: ThroughHole
Q1 Q3 Q5 Q6 = CMP-2000-06467-1: Power MOSFET, 500 V, -55 to 150 degC, 3-Pin FM, RoHS, Tape and Reel; Manufacturer: Vishay; Maximum Gate Source Voltage: ±20V; Channel Mode: Enhancement; Typical Gate Charge @ Vgs: 63nC@10V; Number of Elements per Chip: 1; Typical Turn-On Delay Time: 14ns; Typical Input Capacitance @ Vds: 1300pF@25V; Maximum Continuous Drain Current: 8A; Maximum Drain Source Voltage: 500V; Minimum Gate Threshold Voltage: 2V; Typical Turn-Off Delay Time: 49ns; Maximum Drain Source Resistance: 0.85Ω; Maximum Power Dissipation: 125W; Channel Type: N; Mounting Type: ThroughHole; Datasheet URL: https://datasheet.ciiva.com/26791/irf840pbf-26791500.pdf; Package Type: TO-220AB; Dimensions: 10.41x4.7x9.01mm; Category: PowerMOSFET; Width: 4.7mm; Datasheet Version: Rev. C, 03/2011; Maximum Operating Temperature: +150°C; Manufacturer URL: http://www.vishay.com/; Package Description: 3-Pin Flange Mount, Body 10.275 x 4.45 mm, Pitch 2.54 mm; Length: 10.41mm; Height: 9.01mm; Mounting Technology: ThroughHole; Package Reference: TO-220AB-3; Pin Count: 3; Minimum Operating Temperature: -55°C; Package URL: http://www.vishay.com/docs/71195/to220ab.pdf
Q2 Q4 Q7 Q8 = CMP-1048-00019-1: General Purpose Transistor, NPN Silicon, 3-Pin SOT-23, Pb-Free, Tape and Reel; Manufacturer: On Semiconductor; fT Min (MHz): 100; IC Continuous (A): 0.5; ComponentLink2URL: http://www.onsemi.com/pub_link/Collateral/BC817-16LT1-D.PDF; DatasheetVersion: Rev. 12; ComponentLink3URL: http://www.onsemi.cn/pub_link/Collateral/318-08.PDF; ComponentLink3Description: Package Specification; ComponentLink1Description: Manufacturer URL; Mounting Technology: Surface Mount; ComponentLink1URL: http://www.onsemi.com/; Packing: Tape and Reel; ComponentLink2Description: Datasheet; Polarity: NPN; RoHS: TRUE; PackageVersion: Rev. AP, 11/2009; PartNumber: BC817-40LT1G; PackageDescription: 3-Pin Small Outline Transistor, Body 2.92 x 1.3 mm, Pitch 0.95 mm; PackageReference: SOT-23-3-318-08
R13-R20 = CMP-2001-04476-2: as R1 on sheet ESP32-HWE-Dev-I2C; ComponentLink2URL: http://www.yageo.com/documents/recent/PYu-AC_51_RoHS_L_6.pdf; Power Rating: 1/8W; Package: AC0805; Mouser Description: Thick Film Resistors - SMD 1/8W 4.7K ohm 5% AEC-Q200; Height: 0.6mm; Device Class L2: Resistors; ComponentLink2Description: Datasheet; Series: AC; RoHS: TRUE; Resistance: 4.7KΩ; Digikey Description: RES SMD 4.7K OHM 5% 1/8W 0805; Lead Free: Yes; Category: Res; Temperature Range Low: -55°C; Temperature Range High: +155°C; Composition: Thick Film; Device Class L3: Chip SMD Resistors; Device Class L1: Passive Components; Automotive: Yes; Octopart: https://octopart.com/ac0805jr-074k7l-yageo-26638632; Temperature: -55°C to +155°C; Ipc Land Pattern Name: RESC200125X50; Footprint Url: http://www.yageo.com/exep/pages/download/literatures/PYu-R_Mount_10.pdf
U8 = CMP-2000-06526-1: Dual Full-Bridge Driver, 4.8 to 46 V, -40 to 150 degC, 15-Pin FM (MW 15L), RoHS, Tube; Manufacturer: STMicroelectronics; PartNumber: L298; Output Current: 2A; Supply Voltage Max: 7V; Driver Case Style: Multiwatt; Supply Voltage Min: 4.5V; No. of Pins: 15Pins; SVHC: NoSVHC(17-Dec-2015); Output Voltage: 46V; No. of Outputs: 4Outputs; Motor Type: FullBridge; MSL: -; Package Description: 15-Pin Flange Mount, Body 5 x 19.6 mm, Pitch 1.27 mm; Datasheet Version: 01/2000; Package Reference: FM-15; Mounting Technology: ThroughHole; Packaging: Each; Automotive Qualification Standard: -; Product Range: -; Datasheet URL: https://datasheet.ciiva.com/15109/getdatasheetpartid-50682-15109332.pdf; Operating Temperature Max: 130°C; Operating Temperature Min: -25°C; Manufacturer URL: http://www.st.com/

## Nets that join several sheets
GND: ESP32-HWE-Dev-I2C (26 pins), ESP32-HWE-Dev-SPI (9 pins), ESP32-HWE-Dev (9 pins), ESP32-HWE-Dev-Power (15 pins)
VCC: ESP32-HWE-Dev-I2C (17 pins), ESP32-HWE-Dev-SPI (9 pins), ESP32-HWE-Dev (7 pins), ESP32-HWE-Dev-Power (U8.9)
NetCon5_2: ESP32-HWE-Dev (Con5.2), ESP32-HWE-Dev-Power (U8.5)
NetCon5_3: ESP32-HWE-Dev (Con5.3), ESP32-HWE-Dev-Power (U8.7)
NetCon5_4: ESP32-HWE-Dev (Con5.4), ESP32-HWE-Dev-Power (U8.6)
NetCon5_5: ESP32-HWE-Dev (Con5.5), ESP32-HWE-Dev-Power (U8.10)
NetCon5_6: ESP32-HWE-Dev (Con5.6), ESP32-HWE-Dev-Power (U8.12)
NetCon5_7: ESP32-HWE-Dev (Con5.7), ESP32-HWE-Dev-Power (U8.11)
NetCon5_10: ESP32-HWE-Dev (Con5.10), ESP32-HWE-Dev-Power (U8.2)
NetCon5_11: ESP32-HWE-Dev (Con5.11), ESP32-HWE-Dev-Power (U8.3)
NetCon5_12: ESP32-HWE-Dev (Con5.12), ESP32-HWE-Dev-Power (U8.1)
NetCon5_13: ESP32-HWE-Dev (Con5.13), ESP32-HWE-Dev-Power (U8.15)
NetCon5_14: ESP32-HWE-Dev (Con5.14), ESP32-HWE-Dev-Power (U8.13)
NetCon5_15: ESP32-HWE-Dev (Con5.15), ESP32-HWE-Dev-Power (U8.14)
NetCon6_2: ESP32-HWE-Dev (Con6.2), ESP32-HWE-Dev-Power (R14.1)
NetCon7_2: ESP32-HWE-Dev (Con7.2), ESP32-HWE-Dev-Power (R16.1)
NetCon8_2: ESP32-HWE-Dev (Con8.2), ESP32-HWE-Dev-Power (R19.1)
NetCon9_2: ESP32-HWE-Dev (Con9.2), ESP32-HWE-Dev-Power (R20.1)
NetCon25_2: ESP32-HWE-Dev-SPI (Con25.2 Con26.1), ESP32-HWE-Dev (SW3.6)
NetDS1_2: ESP32-HWE-Dev-I2C (6 pins), ESP32-HWE-Dev (SW1.6)
NetDS1_3: ESP32-HWE-Dev-I2C (6 pins), ESP32-HWE-Dev (SW1.2)
NetSW2_2: ESP32-HWE-Dev-SPI (U7.6), ESP32-HWE-Dev (SW2.2)
NetSW2_6: ESP32-HWE-Dev-SPI (U6.4), ESP32-HWE-Dev (SW2.6)
NetSW3_2: ESP32-HWE-Dev-SPI (U6.3 U7.7), ESP32-HWE-Dev (SW3.2)